# EAGLE schematic SNES1Chip_SCIC_IGR_D4_Takt (EAGLE 6.4)
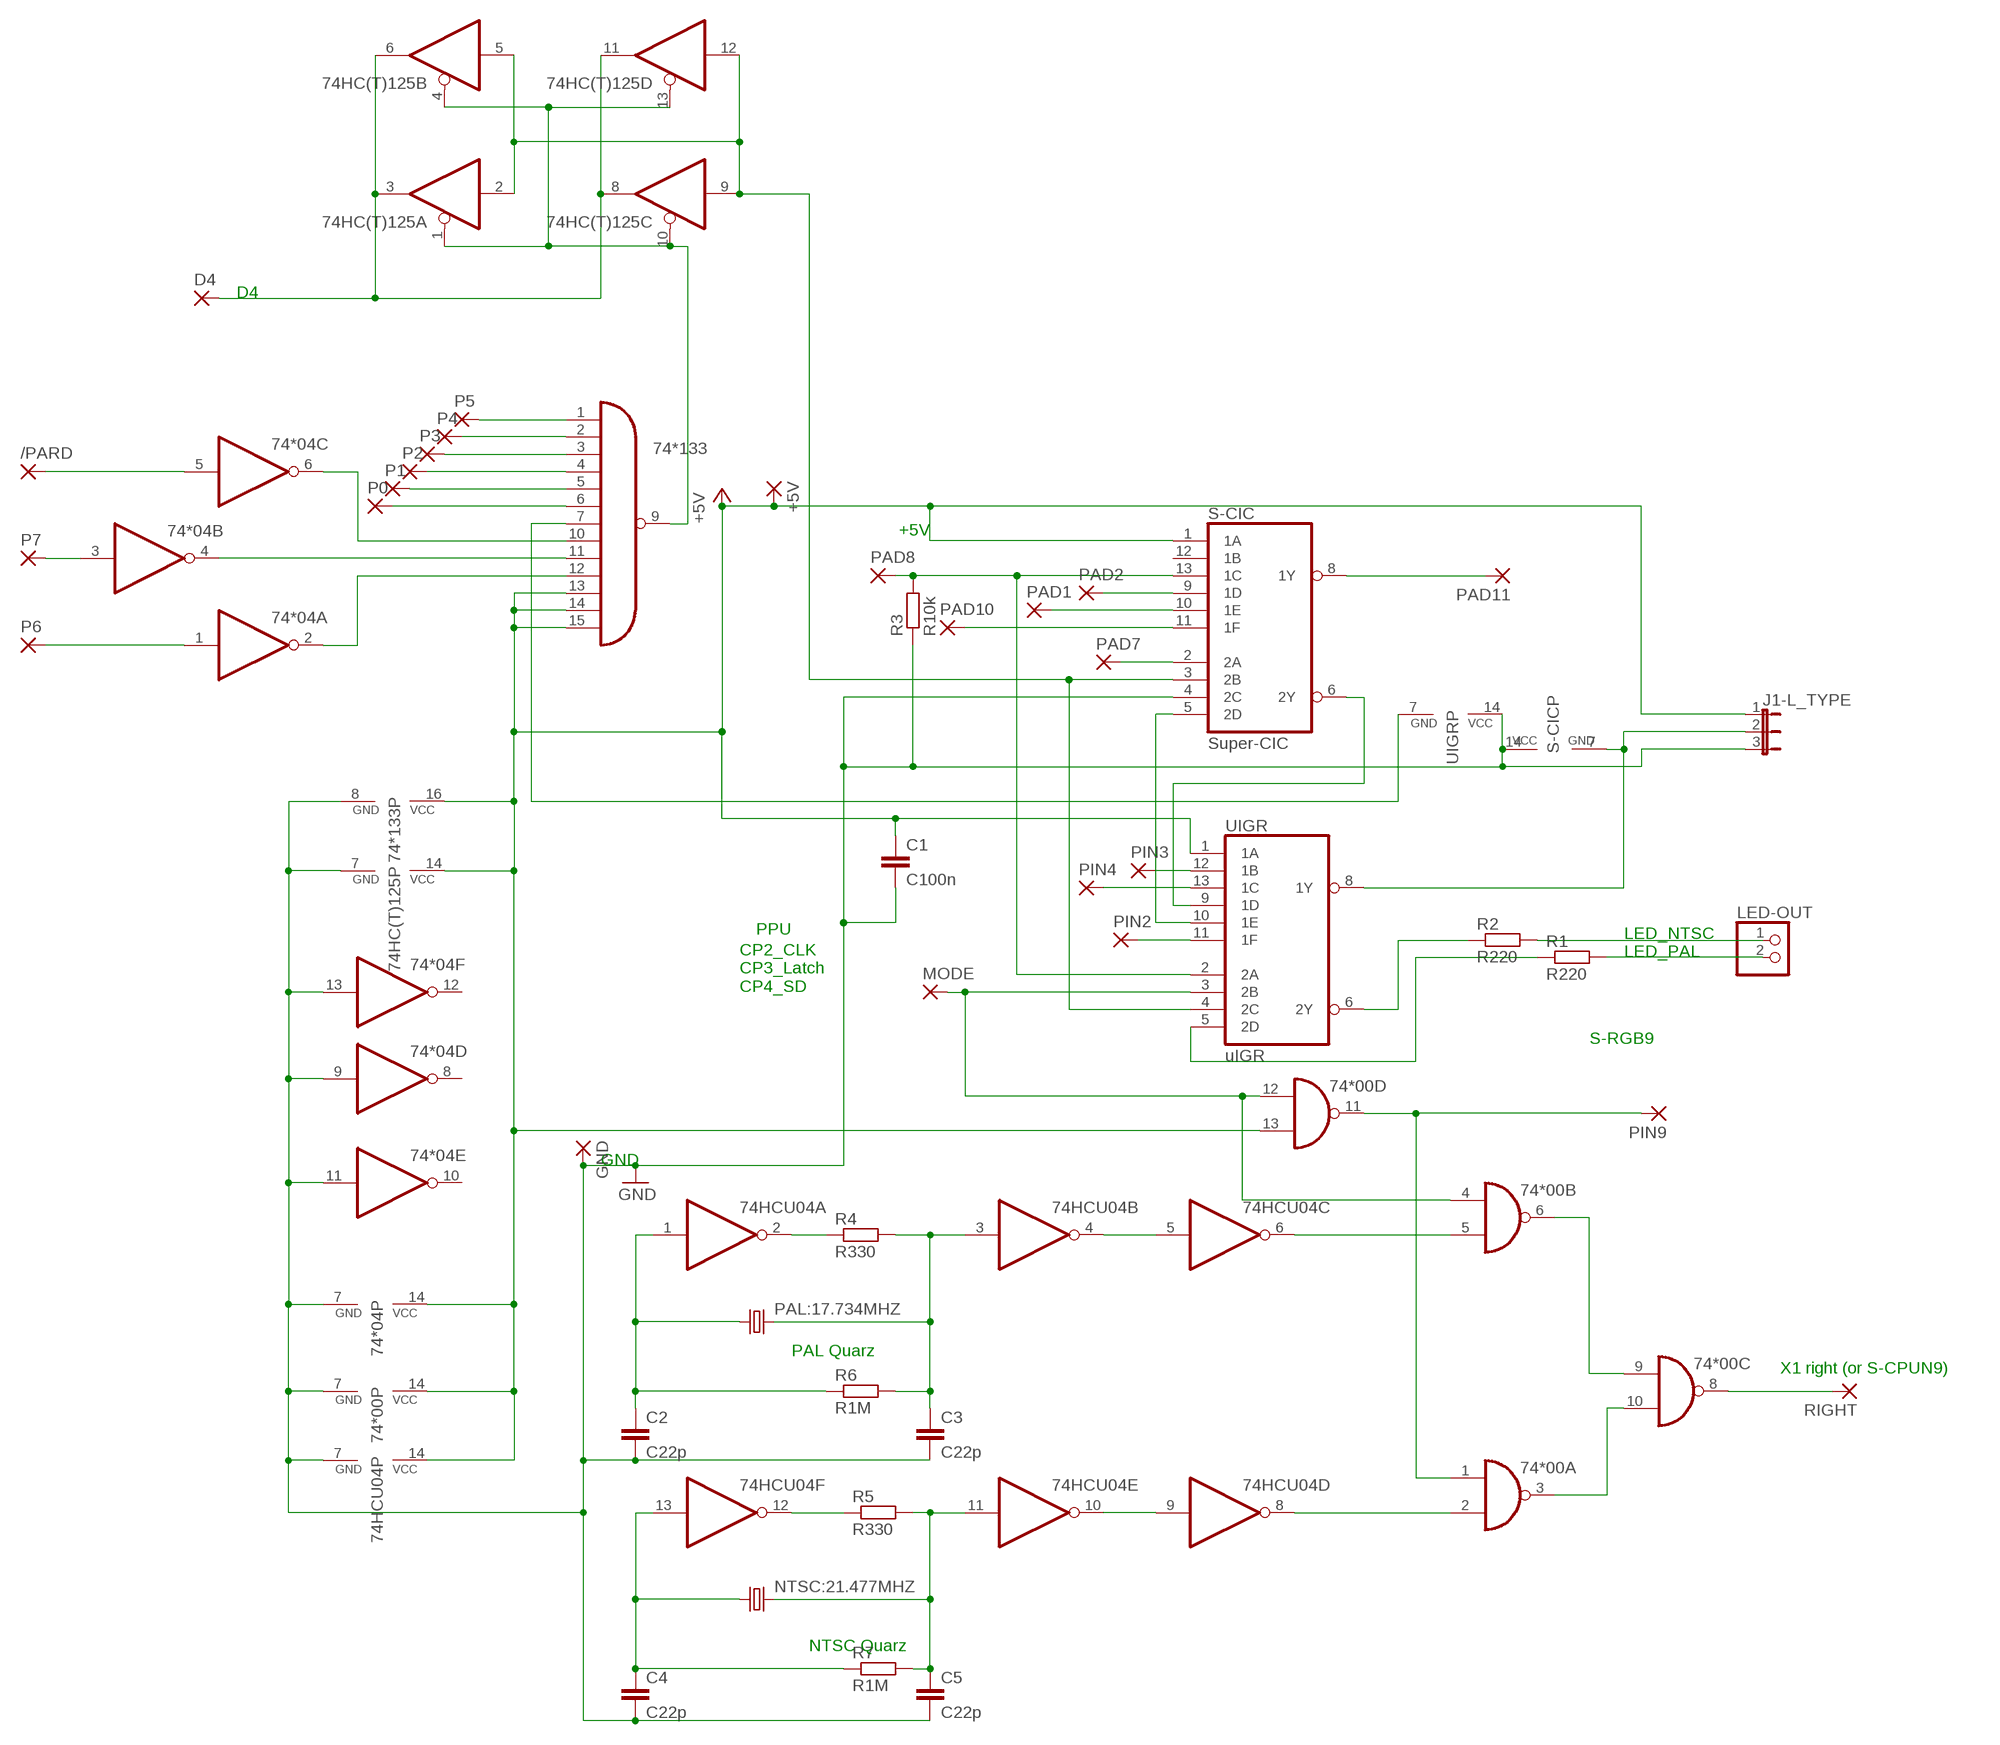
[diagram p0: schematic, sheet 1]

## Parts
74*00  7400D  [SO14]
74*04  74S04D  [SO14]
74*133  74S133D  [SO16]
74HC(T)125  74HCT125D  [SO14]
74HCU04  74HC04D  [SO14]
+5V  2,54/0,8  [2,54/0,8]
/PARD  2,54/0,8  [2,54/0,8]
C1  C100n  C-EUC0805  [C0805]
C2  C22p  C-EUC0805  [C0805]
C3  C22p  C-EUC0805  [C0805]
C4  C22p  C-EUC0805  [C0805]
C5  C22p  C-EUC0805  [C0805]
D4  2,54/0,8  [2,54/0,8]
GND  2,54/0,8  [2,54/0,8]
J1-L_TYPE  JP2E  [JP2]
LED-OUT  PINHD-1X2  [1X02]
MODE  2,54/0,8  [2,54/0,8]
NTSC:21.477MHZ  CRYSTALHC49S  [HC49/S]
P0  2,54/0,8  [2,54/0,8]
P1  2,54/0,8  [2,54/0,8]
P2  2,54/0,8  [2,54/0,8]
P3  2,54/0,8  [2,54/0,8]
P4  2,54/0,8  [2,54/0,8]
P5  2,54/0,8  [2,54/0,8]
P6  2,54/0,8  [2,54/0,8]
P7  2,54/0,8  [2,54/0,8]
PAD1  2,54/0,8  [2,54/0,8]
PAD2  2,54/0,8  [2,54/0,8]
PAD7  2,54/0,8  [2,54/0,8]
PAD8  2,54/0,8  [2,54/0,8]
PAD10  2,54/0,8  [2,54/0,8]
PAD11  2,54/0,8  [2,54/0,8]
PAL:17.734MHZ  CRYSTALHC49S  [HC49/S]
PIN2  2,54/0,8  [2,54/0,8]
PIN3  2,54/0,8  [2,54/0,8]
PIN4  2,54/0,8  [2,54/0,8]
PIN9  2,54/0,8  [2,54/0,8]
R1  R220  R-EU_R0805  [R0805]
R2  R220  R-EU_R0805  [R0805]
R3  R10k  R-EU_R0805  [R0805]
R4  R330  R-EU_R0805  [R0805]
R5  R330  R-EU_R0805  [R0805]
R6  R1M  R-EU_R0805  [R0805]
R7  R1M  R-EU_R0805  [R0805]
RIGHT  2,54/0,8  [2,54/0,8]
S-CIC  Super-CIC  74HC51D  [SO14]
UIGR  uIGR  74HC51D  [SO14]

## Nets
+5V: 74*00.13(D:I1) 74*00.14(P:VCC) 74*04.14(P:VCC) 74*133.13(I10) 74*133.14(I11) 74*133.15(I12) 74*133.16(VCC) 74HC(T)125.14(P:VCC) 74HCU04.14(P:VCC) +5V.1(P) C1.1 J1-L_TYPE.1 S-CIC.1(1A) UIGR.1(1A)
GND: 74*00.7(P:GND) 74*04.7(P:GND) 74*04.9(D:I) 74*04.11(E:I) 74*04.13(F:I) 74*133.8(GND) 74HC(T)125.7(P:GND) 74HCU04.7(P:GND) C1.2 C2.2 C3.2 C4.2 C5.2 GND.1(P) J1-L_TYPE.3 R3.1 S-CIC.4(2C) S-CIC.14(VCC) UIGR.14(VCC)
N$1: 74*04.4(B:O) 74*133.11(I8)
N$2: 74*133.9(O) 74HC(T)125.1(A:OE) 74HC(T)125.4(B:OE) 74HC(T)125.10(C:OE) 74HC(T)125.13(D:OE)
N$3: PAD10.1(P) S-CIC.11(1F)
N$4: PAD11.1(P) S-CIC.8(1Y)
N$5: LED-OUT.1 R2.2
N$6: 74*04.1(A:I) P6.1(P)
N$7: R2.1 UIGR.6(2Y)
N$8: J1-L_TYPE.2 S-CIC.7(GND) UIGR.8(1Y)
N$9: 74*04.6(C:O) 74*133.10(I7)
N$10: PAD7.1(P) S-CIC.2(2A)
N$11: R1.1 UIGR.5(2D)
N$12: PAD2.1(P) S-CIC.9(1D)
N$13: PAD1.1(P) S-CIC.10(1E)
N$14: LED-OUT.2 R1.2
N$15: 74*133.6(I5) P0.1(P)
N$16: 74*04.3(B:I) P7.1(P)
N$17: PIN2.1(P) UIGR.11(1F)
N$18: PIN3.1(P) UIGR.12(1B)
N$19: PIN4.1(P) UIGR.13(1C)
N$20: 74*04.2(A:O) 74*133.12(I9)
N$21: 74*133.1(I0) P5.1(P)
N$22: 74*133.2(I1) P4.1(P)
N$23: S-CIC.6(2Y) UIGR.9(1D)
N$24: 74*133.3(I2) P3.1(P)
N$25: 74*133.4(I3) P2.1(P)
N$26: 74*04.5(C:I) /PARD.1(P)
N$27: 74HCU04.1(A:I) C2.1 PAL:17.734MHZ.1 R6.1
N$28: 74HCU04.3(B:I) C3.1 PAL:17.734MHZ.2 R4.2 R6.2
N$29: 74HCU04.13(F:I) C4.1 NTSC:21.477MHZ.1 R7.1
N$30: 74HCU04.11(E:I) C5.1 NTSC:21.477MHZ.2 R5.2 R7.2
N$31: 74*00.3(A:O) 74*00.10(C:I1)
N$32: 74*00.6(B:O) 74*00.9(C:I0)
N$33: 74*00.4(B:I0) 74*00.12(D:I0) MODE.1(P) UIGR.3(2B)
N$34: PAD8.1(P) R3.2 S-CIC.13(1C) UIGR.2(2A)
N$35: 74*00.1(A:I0) 74*00.11(D:O) PIN9.1(P)
N$36: 74*00.8(C:O) RIGHT.1(P)
N$37: 74HCU04.2(A:O) R4.1
N$38: 74HCU04.4(B:O) 74HCU04.5(C:I)
N$39: 74*00.5(B:I1) 74HCU04.6(C:O)
N$40: 74*133.5(I4) P1.1(P)
N$41: 74*00.2(A:I1) 74HCU04.8(D:O)
N$42: 74HC(T)125.3(A:O) 74HC(T)125.6(B:O) 74HC(T)125.8(C:O) 74HC(T)125.11(D:O) D4.1(P)
N$43: 74*133.7(I6) UIGR.7(GND)
N$44: 74HCU04.9(D:I) 74HCU04.10(E:O)
N$50: 74HCU04.12(F:O) R5.1
N$53: S-CIC.5(2D) UIGR.10(1E)
UIGR: 74HC(T)125.2(A:I) 74HC(T)125.5(B:I) 74HC(T)125.9(C:I) 74HC(T)125.12(D:I) S-CIC.3(2B) UIGR.4(2C)
Unconnected: 74*04.8(D:O) 74*04.10(E:O) 74*04.12(F:O) S-CIC.12(1B)

## Notes on the sheet
- D4
- +5V
- PPU
- LED_NTSC
  LED_PAL
- CP2_CLK
  CP3_Latch
  CP4_SD
- S-RGB9
- GND
- PAL Quarz
- X1 right (or S-CPUN9)
- NTSC Quarz

## Library data of the parts
74*00 = 74xx-eu:74*00: Quad 2-input NAND gate
74*04 74HCU04 = 74xx-eu:74*04: Hex INVERTER
74*133 = 74xx-eu:74*133: 13-input NAND gate
74HC(T)125 = 74xx-eu:74*125: Quad bus BUFFER, 3-state
+5V /PARD D4 GND MODE P0 P1-P7 PAD1 PAD2 PAD7 PAD8 PAD10 PAD11 PIN2-PIN4 PIN9 RIGHT = wirepad:2,54/0,8: THROUGH-HOLE PAD
C1-C5 = rcl:C-EU: CAPACITOR, European symbol
J1-L_TYPE = jumper:JP2E: JUMPER
LED-OUT = pinhead:PINHD-1X2: PIN HEADER
NTSC:21.477MHZ PAL:17.734MHZ = crystal:CRYSTAL: CRYSTAL; OC_FARNELL: 1667008; OC_NEWARK: unknown
R1-R7 = rcl:R-EU_: RESISTOR, European symbol
S-CIC UIGR = 74xx-eu:74*51: AND-OR-INVERT gates/for S-type see 74S51 <DEVICE:74S51>